# Altium project PB-F-0213 Fusion - SUPI Platform.PrjPcb
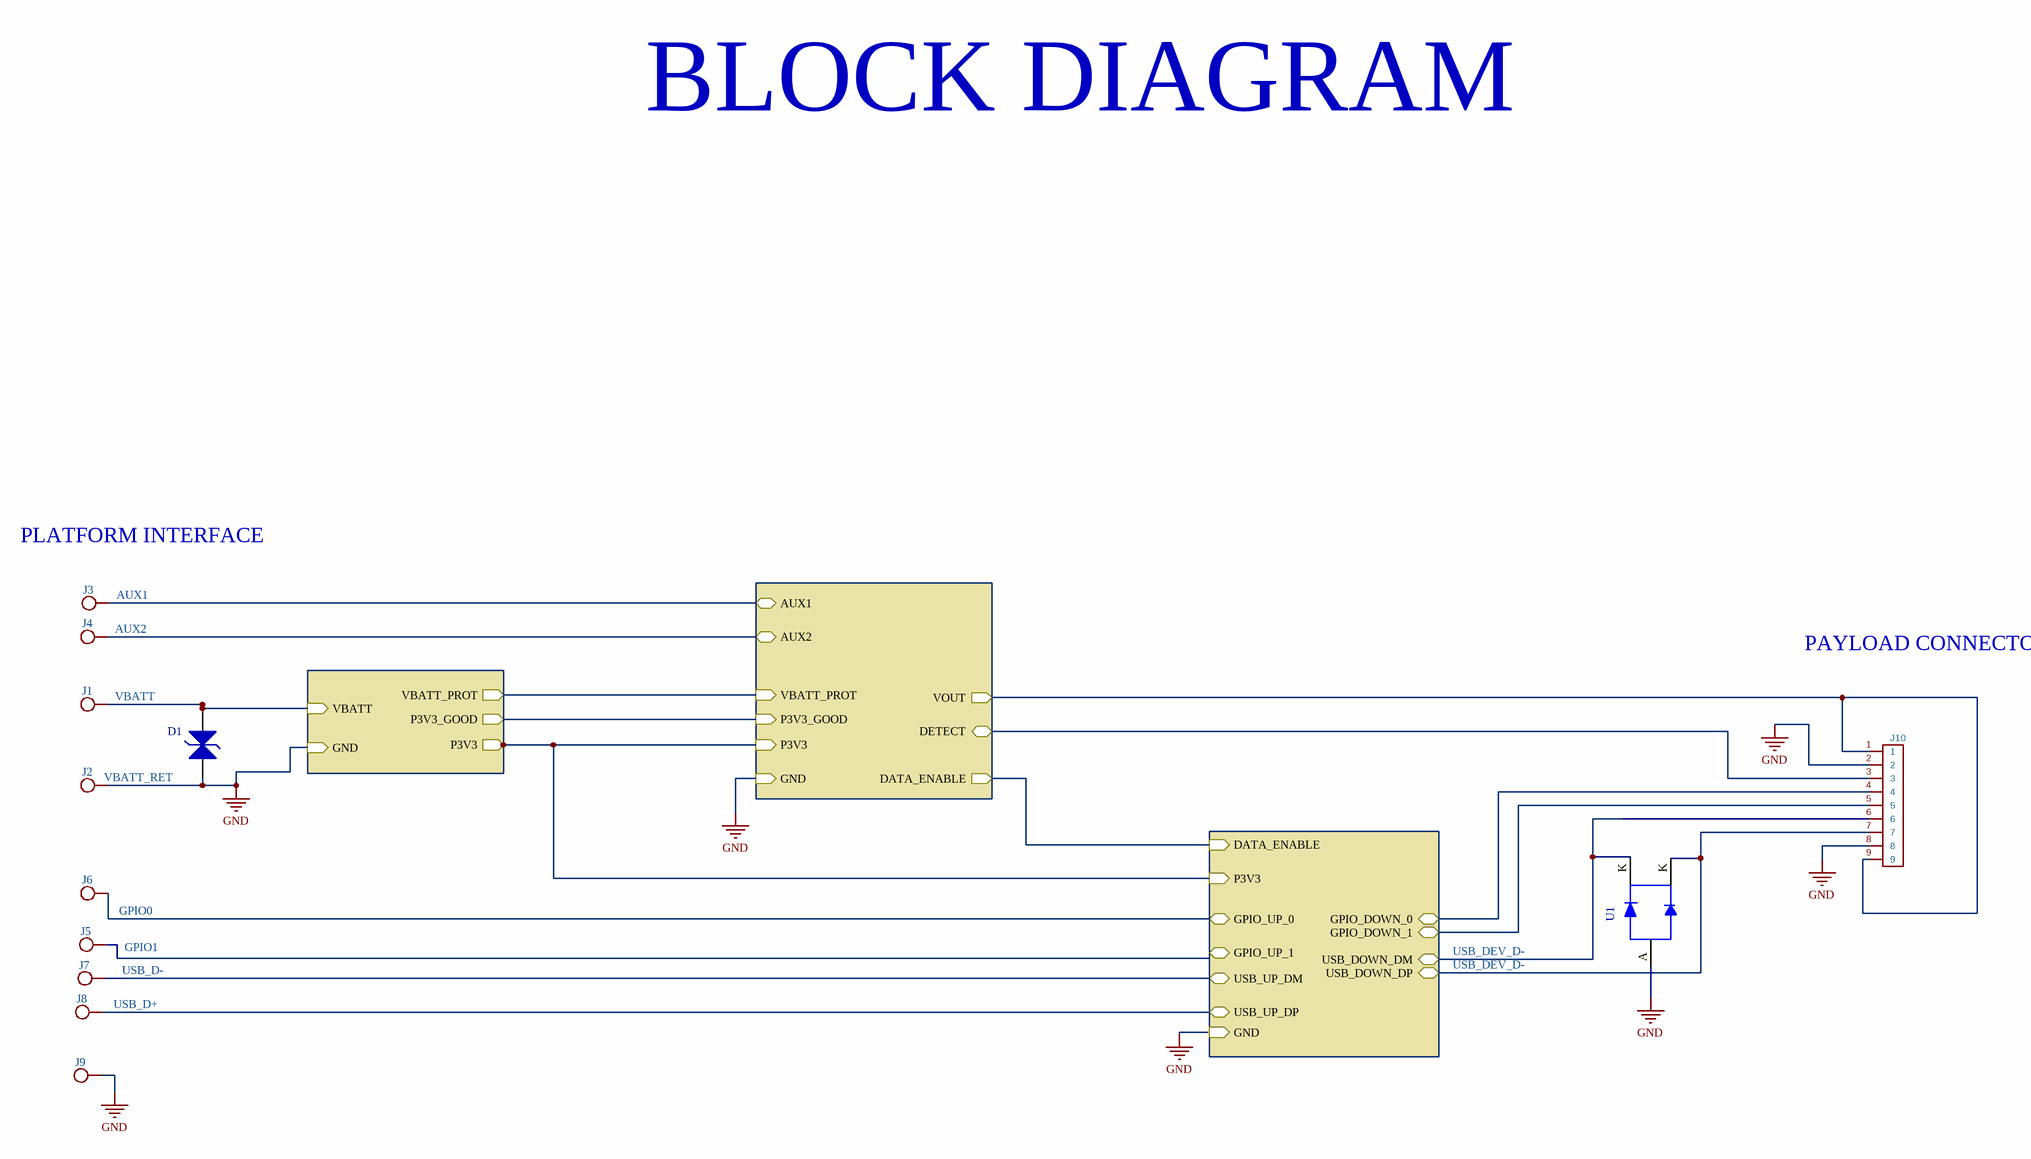
[diagram p0: 100046138_block_diagram.SchDoc]
Part_Number: PB-F-0210
4 sheets, 82 parts. Net scope: hierarchical (ports join the sheet entries above them; power ports are global).
Board file: 100064667.PcbDoc
Sheets:
  100046138_block_diagram.SchDoc
    Data Switches = 100046138_data_switches.SchDoc
    Payload Power Control = 100046138_output_control.SchDoc
    Power Input = 100046138_power.SchDoc

## Sheet 100046138_block_diagram.SchDoc
size 863 x 558 mm; SheetNumber: 1; SheetTotal: 4

### Parts
D1  SMF26A  [DI-SOD123F-A]  (value not drawn)
J1  ~  [PTH_18AWG]  (value not drawn)
J2  (no value)  [PTH_18AWG]
J3  (no value)  [PTH_24AWG_offset_rectangular]
J4  (no value)  [PTH_24AWG_offset_rectangular]
J5  (no value)  [PTH_24AWG_offset_rectangular]
J6  ~  [PTH_24AWG_offset_rectangular]  (value not drawn)
J7  ~  [PTH_24AWG_offset_rectangular]  (value not drawn)
J8  ~  [PTH_24AWG_offset_rectangular]  (value not drawn)
J9  ~  [PTH_24AWG_offset_rectangular]  (value not drawn)
J10  ~  [399-10-109-10-007000]  (value not drawn)
U1  PESD5V0C2UM  [IC-SOT883-2-B]  (value not drawn)

### Sub-sheets
Data Switches = 100046138_data_switches.SchDoc: GND (in), P3V3 (in), USB_DOWN_DP (bidir), USB_DOWN_DM (bidir), USB_UP_DP (bidir), USB_UP_DM (bidir), DATA_ENABLE (in), GPIO_DOWN_0 (bidir), GPIO_DOWN_1 (bidir), GPIO_UP_0 (bidir), GPIO_UP_1 (bidir)
Payload Power Control = 100046138_output_control.SchDoc: P3V3 (in), GND (in), VOUT (out), VBATT_PROT (in), AUX1 (bidir), AUX2 (bidir), P3V3_GOOD (in), DETECT (bidir), DATA_ENABLE (out)
Power Input = 100046138_power.SchDoc: VBATT (in), GND (in), P3V3 (out), VBATT_PROT (out), P3V3_GOOD (out)

### Nets
GND: D1.A J2.1 J9.1 J10.2 J10.8 U1.A ; sheet Payload Power Control/GND, sheet Power Input/GND
AUX1: J3.1 ; sheet Payload Power Control/AUX1
AUX2: J4.1 ; sheet Payload Power Control/AUX2
GPIO0: J6.1 ; sheet Data Switches/GPIO_UP_0
USB_D+: J8.1 ; sheet Data Switches/USB_UP_DP
USB_D-: J7.1 ; sheet Data Switches/USB_UP_DM
USB_DEV_D-: J10.6 J10.7 U1.K ; sheet Data Switches/USB_DOWN_DP, sheet Data Switches/USB_DOWN_DM
VBATT: D1.K J1.1 ; sheet Power Input/VBATT
NetC2_2: sheet Payload Power Control/VBATT_PROT, sheet Power Input/VBATT_PROT
NetC4_2: sheet Data Switches/P3V3, sheet Payload Power Control/P3V3, sheet Power Input/P3V3
NetC8_2: J10.3 ; sheet Payload Power Control/DETECT
NetC15_1: J10.1 J10.9 ; sheet Payload Power Control/VOUT
NetJ10_4: J10.4 ; sheet Data Switches/GPIO_DOWN_0
NetJ10_5: J10.5 ; sheet Data Switches/GPIO_DOWN_1
NetU4_5: sheet Payload Power Control/P3V3_GOOD, sheet Power Input/P3V3_GOOD
NetU11_4: sheet Data Switches/DATA_ENABLE, sheet Payload Power Control/DATA_ENABLE

Not connected (* = marked no-connect by the designer): J5 1

### Notes on the sheet
- BLOCK DIAGRAM
- PLATFORM INTERFACE
- PAYLOAD CONNECTOR
- Labels drawn without touching a wire or pin: GPIO1, VBATT_RET
- DWG NO
- REVISIONS
- SH
- REVISION
- DESCRIPTION
- DATE(YEAR-MO-DA)
- APPROVED
- THIS DRAWING IS CAD MAINTAINED.
  CHANGES SHALL BE INCORPORATED
  BY THE DESIGN ACTIVITY.
- PART NO.
- CONTRACT NUMBER
- DESIGN ACTIVITY
- CONTRACTOR
- US ARMY
  COMBAT CAPABILITIES DEVELOPMENT COMMAND ARMAMENTS CENTER
  PICATINNY ARSENAL, NEW JERSEY 07806-5000
- DRAWN BY
- ENGINEER
- CHECKER
- QUALITY ENGINEER
- DRAWING APPROVAL
- SIZE
- CAGE CODE
- DWG NO.
- NEXT ASSY
- USED ON
- DESIGN APPROVAL
- D
- 19200
- APPLICATION
- SCALE
- NONE
- UNIT WT.
- ---
- SHEET

### Library data of the parts
D1 = CMP-00657-1: SMF Series 200 W 26 V Uni-Directional Surface Mount TVS Diode - SOD-123F; Breakdown Voltage: 30.4V; Clamping Voltage: 42.1V; Max Breakdown Voltage: 31.9V; Max Power Dissipation: 1W; Max Reverse Leakage Current: 1µA; Max Surge Current: 4.8A; Min Breakdown Voltage: 28.9V; Number of Channels: 1; Peak Pulse Power: 1kW; Polarity: Unidirectional; Power Line Protection: No; Reverse Standoff Voltage: 26V; Test Current: 1mA; Footprint: 1a_Littelfuse:SOD-123FL; Composition: Zener; Lead Free: Lead Free; Lifecycle Status: Production; Max Operating Temperature: 150°C; Min Operating Temperature: -65°C; Mounting Technology: Surface Mount; Number of Elements: 1; Number of Terminals: 2; Number of Unidirectional Channels: 1; Packaging: Cut Tape; Peak Pulse Current: 4.8A; Peak Reverse Current: 1µA; REACH SVHC: No; Reverse Voltage: 26V; RoHS: Compliant; Schedule B: 8541100080; Termination: SMD/SMT
J1 J2 = PTH_18AWG: Footprint: 1a_Misc:PTH_18AWG
J3-J9 = PTH_24AWG_offset_rectangle: Footprint: 1a_Misc:PTH_24AWG_offset_rectangular
J10 = 399-10-109-10-007000: Manufacturer: Mill-Max Manufacturing Corp.; MPN: 399-10-109-10-007000; Footprint: 1a_Misc:399-10-109-10-007000
U1 = CMP-00652-2: Extremely low capacitance unidirectional ESD protection diode array; Manufacturer Lifecycle Status: RELEASED FOR SUPPLY; Lifecycle Status: Production

## Sheet 100046138_data_switches.SchDoc
size 863 x 558 mm; SheetNumber: 2; SheetTotal: 4
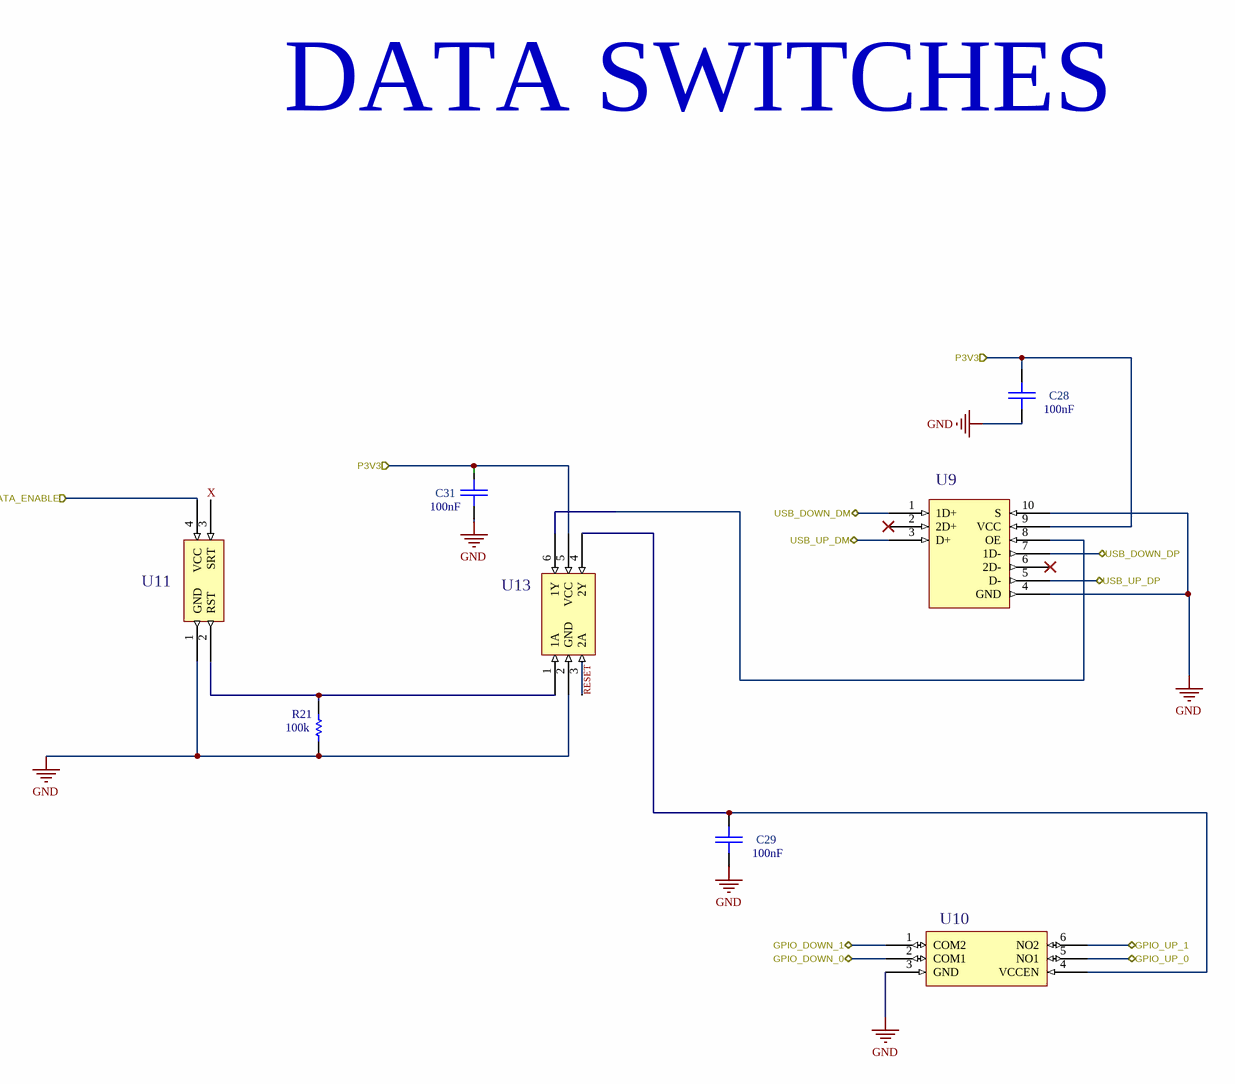
[diagram p1: 100046138_data_switches.SchDoc]

### Parts
C28  value 100nF  [CAP-0402-A]  (hidden comment: Cap 0402 100nF 10% X7R)
C29  value 100nF  [CAP-0402-A]  (hidden comment: Cap 0402 100nF 10% X7R)
C31  value 100nF  [CAP-0402-A]  (hidden comment: Cap 0402 100nF 10% X7R)
R21  value 100k  [RES-0402-C]  (hidden comment: Res 0402 100K 1/10W 1% Thick Flim)
U9  TC7USB40MU  [IC-UQFN10-A]  (value not drawn)
U10  MAX20336AEFT+T  [IC-FC2QFN-A]  (value not drawn)
U11  MAX821UUS+T  [IC-SOT143-4-A]  (value not drawn)
U13  SN74AUP2G04DRYR  [IC-SON6-A]  (value not drawn)

### Ports
DATA_ENABLE (in), GPIO_DOWN_0 (bidir), GPIO_DOWN_1 (bidir), GPIO_UP_0 (bidir), GPIO_UP_1 (bidir), P3V3 (in), USB_DOWN_DM (bidir), USB_DOWN_DP (bidir), USB_UP_DM (bidir), USB_UP_DP (bidir)

### Nets
GND: C28.1 C29.1 C31.2 R21.1 U9.4(GND) U9.10(S) U10.3(GND) U11.1(GND) U13.2(GND)
GPIO0: U10.5(NO1) ; port GPIO_UP_0
USB_D+: U9.5(D-) ; port USB_UP_DP
USB_D-: U9.3(D+) ; port USB_UP_DM
USB_DEV_D-: U9.1(1D+) U9.7(1D-) ; port USB_DOWN_DP, port USB_DOWN_DM
NetC4_2: C28.2 C31.1 U9.9(VCC) U13.5(VCC) ; port P3V3
NetC29_2: C29.2 U10.4(VCCEN) U13.4(2Y)
NetJ10_4: U10.2(COM1) ; port GPIO_DOWN_0
NetJ10_5: U10.1(COM2) ; port GPIO_DOWN_1
NetR21_2: R21.2 U11.2(RST) U13.1(1A)
NetU9_8: U9.8(OE) U13.6(1Y)
NetU10_6: U10.6(NO2) ; port GPIO_UP_1
NetU11_4: U11.4(VCC) ; port DATA_ENABLE

Not connected (* = marked no-connect by the designer): U9 2(2D+)* 6(2D-)*; U11 3(SRT); U13 3(2A)

### Notes on the sheet
- DATA SWITCHES
- (near U11) X
- Labels drawn without touching a wire or pin: RESET
- DWG NO
- REVISIONS
- SH
- REVISION
- DESCRIPTION
- DATE(YEAR-MO-DA)
- APPROVED
- PART NO.
- DESIGN ACTIVITY
- US ARMY
  COMBAT CAPABILITIES DEVELOPMENT COMMAND ARMAMENTS CENTER
  PICATINNY ARSENAL, NEW JERSEY 07806-5000
- SIZE
- CAGE CODE
- DWG NO.
- D
- 19200
- SCALE
- NONE
- UNIT WT.
- ---
- SHEET

### Library data of the parts
C28 C29 C31 = CAP-00363-2: Leader Qty: 100; UOM: EA; Voltage Rating: 50V; Footprint: Capacitor_SMD:C_0402_1005Metric; Case/Package: 0402; Max Operating Temperature: 125°C; Min Operating Temperature: -55°C; Mounting Technology: Surface Mount; Tolerance: 10%
R21 = RES-00031-9: Leader Qty: 100; Footprint: Resistor_SMD:R_0402_1005Metric; Case/Package: 0402; Max Operating Temperature: 155°C; Min Operating Temperature: -55°C; Mounting Technology: SMT; Pins: 2; RoHS Compliant: Yes; Tolerance: 1%
U9 = IC-00423-1: USB Interface, 1: 2 Multiplexer/Demultiplexer Switch, USB 2.0, 2.3 V, 4.3 V, UQFN-B, 10 Pins; Footprint: 1a_Misc:Toshiba UQFN-10_1.4x1.8mm_P0.4mm; Schedule B: 8542390000|8542390000|8542390000|8542390000|8542390000
U10 = IC-00417-1: Industry's Smallest DPST Can Switch ±5.5V Signals with a Single VCC as Low as 1.6V; Manufacturer Lifecycle Status: PRODUCTION; Footprint: 1a_Misc:FC2QFN-6; Lifecycle Status: Production; RoHS: Compliant
U11 = IC-00421-1: 4-Pin, µP Voltage Monitors with Pin-Selectable Power-On Reset Timeout Delay; Manufacturer Lifecycle Status: PRODUCTION; Max Power Dissipation: 320mW; Max Reset Threshold Voltage: 2.81V; Max Supply Current: 5.5µA; Max Supply Voltage: 5.5V; Min Reset Threshold Voltage: 2.74V; Min Supply Voltage: 1V; Nominal Supply Current: 1.8µA; Number of Outputs: 1; Output Current: 20mA; Reset: Active Low; Threshold Voltage: 2.78V; Watchdog Timer: No; Footprint: 1a_Misc:SOT-143 Maxim; Case/Package: SOT-143-4; Height: 1.22mm; Lead Free: Lead Free; Lifecycle Status: Production; Max Operating Temperature: 125°C; Min Operating Temperature: -40°C; Mounting Technology: Surface Mount; Number of Voltages Monitored: 1; Operating Supply Current: 5.5µA; Overvoltage Threshold: 2.81V; Pins: 4; Radiation Hardening: No; RoHS: Compliant; Type: Simple Reset/Power-On Reset; Undervoltage Threshold: 2.74V
U13 = IC-00422-1: IC INVERTER 2CH 2-INP 6SON Inverter IC 2 Channel 6-SON (1.45x1); Manufacturer Lifecycle Status: ACTIVE; High Level Output Current: -4mA; Logic Function: Buffer, Inverter; Low Level Output Current: 4mA; Max Supply Voltage: 3.6V; Min Supply Voltage: 800mV; Number of Bits: 2; Number of Inputs: 1; Propagation Delay: 6.2ns; Quiescent Current: 500nA; Turn-On Delay Time: 25.5ns; Footprint: 1a_Misc:QFN-6_1.4x1mm_P0.5mm TI DRY6; Height: 600µm; Lead Free: Lead Free; Length: 1.45mm; Lifecycle Status: Production; Max Operating Temperature: 85°C; Min Operating Temperature: -40°C; Mounting Technology: Surface Mount; Number of Circuits: 2; Number of Elements: 2; Number of Gates: 2; Packaging: Digi-Reel®; Pins: 6; Radiation Hardening: No; RoHS: Compliant; Thickness: 500µm; Width: 1mm

## Sheet 100046138_output_control.SchDoc
size 863 x 558 mm; SheetNumber: 3; SheetTotal: 4
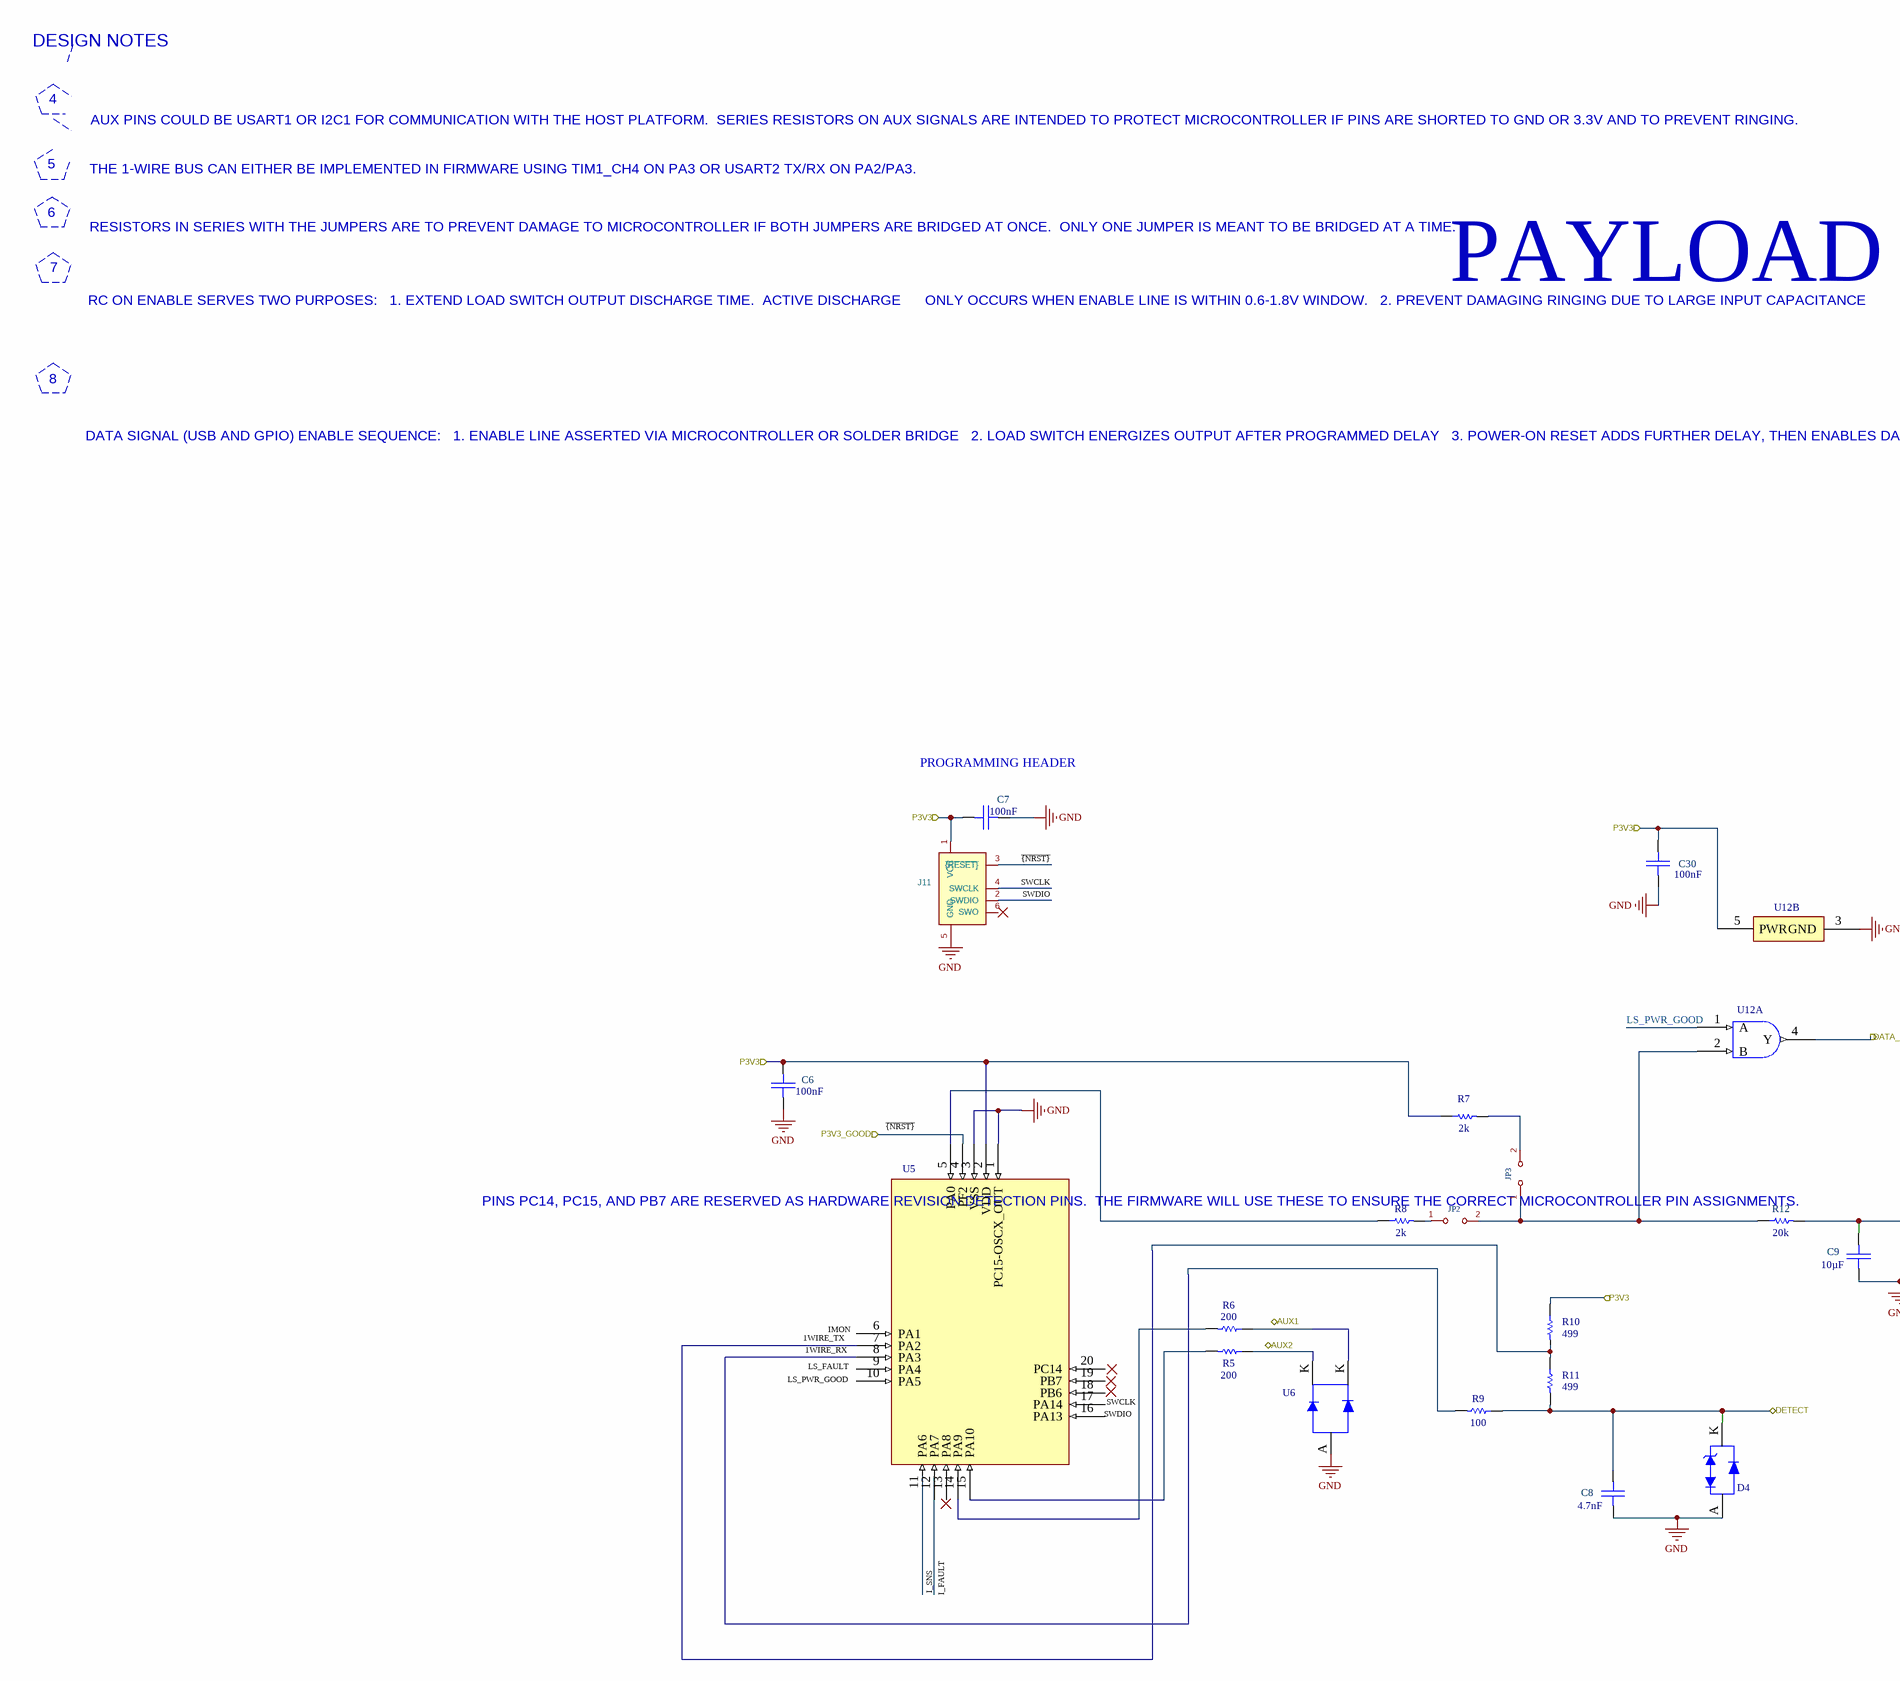
[diagram p2: 100046138_output_control.SchDoc, left]
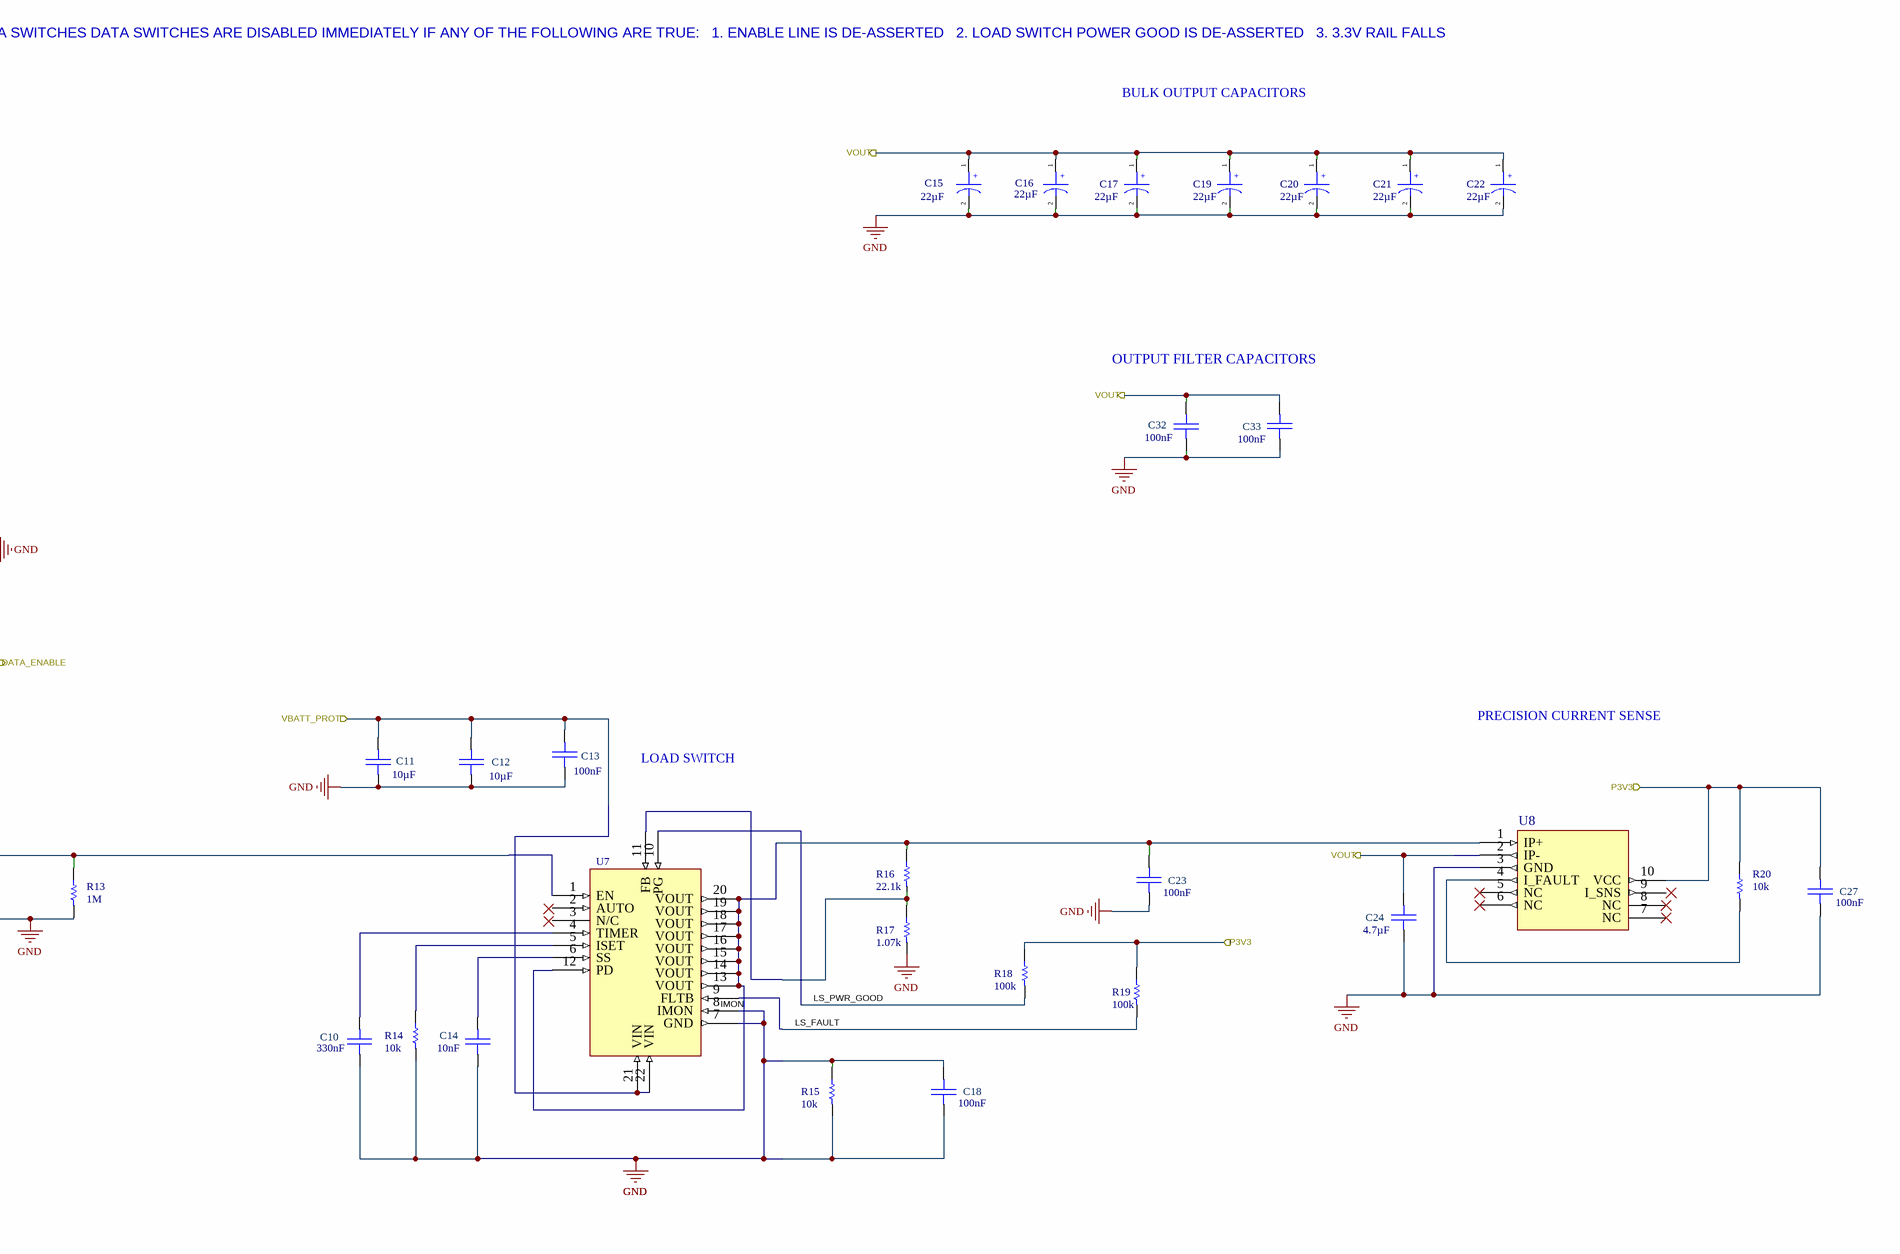
[diagram p3: 100046138_output_control.SchDoc, right]

### Parts
C6  value 100nF  [CAP-0402-A]  (hidden comment: Cap 0402 100nF 10% X7R)
C7  value 100nF  [CAP-0402-A]  (hidden comment: Cap 0402 100nF 10% X7R)
C8  value 4.7nF  [CAP-0402-A]  (hidden comment: CAP 0402 4700PF 50V 10% X7R)
C9  value 10µF  [CAP-0402-A]  (hidden comment: Cap 0402 10uF 10V 20% X5R)
C10  value 330nF  [CAP-0402-A]  (hidden comment: Cap 0402 0.33uF 16V 10% X7S)
C11  value 10µF  [CAP-0805-A]  (hidden comment: CAP 0805 10UF 50V 10% X5R)
C12  value 10µF  [CAP-0805-A]  (hidden comment: CAP 0805 10UF 50V 10% X5R)
C13  value 100nF  [CAP-0402-A]  (hidden comment: Cap 0402 100nF 10% X7R)
C14  value 10nF  [CAP-0402-A]  (hidden comment: Cap 0402 10000pf 50V 10% X7R)
C15  value 22µF  [CAP-0805-A]  (hidden comment: CAP 0805 22uF 35V 20% X5R)
C16  value 22µF  [CAP-0805-A]  (hidden comment: CAP 0805 22uF 35V 20% X5R)
C17  value 22µF  [CAP-0805-A]  (hidden comment: CAP 0805 22uF 35V 20% X5R)
C18  value 100nF  [CAP-0402-A]  (hidden comment: Cap 0402 100nF 10% X7R)
C19  value 22µF  [CAP-0805-A]  (hidden comment: CAP 0805 22uF 35V 20% X5R)
C20  value 22µF  [CAP-0805-A]  (hidden comment: CAP 0805 22uF 35V 20% X5R)
C21  value 22µF  [CAP-0805-A]  (hidden comment: CAP 0805 22uF 35V 20% X5R)
C22  value 22µF  [CAP-0805-A]  (hidden comment: CAP 0805 22uF 35V 20% X5R)
C23  value 100nF  [CAP-0402-A]  (hidden comment: Cap 0402 100nF 10% X7R)
C24  value 4.7µF  [CAP-0805-A]  (hidden comment: CAP 0805 4.7UF 50V 10% X7R)
C27  value 100nF  [CAP-0402-A]  (hidden comment: Cap 0402 100nF 10% X7R)
C30  value 100nF  [CAP-0402-A]  (hidden comment: Cap 0402 100nF 10% X7R)
C32  value 100nF  [CAP-0402-A]  (hidden comment: Cap 0402 100nF 10% X7R)
C33  value 100nF  [CAP-0402-A]  (hidden comment: Cap 0402 100nF 10% X7R)
D4  SMF3.3  [DI-SOD123F-A]  (value not drawn)
J11  Conn_ARM_SWD_TagConnect_TC2030-NL  [Tag-Connect_TC2030-IDC-NL_2x03_P1.27mm_Vertical]  (value not drawn)
JP2  Jumper_2_Bridged  [SolderJumper-2_P1.3mm_Open_TrianglePad1.0x1.5mm]  (value not drawn)
JP3  Jumper_2_Open  [SolderJumper-2_P1.3mm_Open_TrianglePad1.0x1.5mm]  (value not drawn)
R5  value 200  [RES-0402-A]  (hidden comment: RES 0402 200 OHM 1/10W 1%)
R6  value 200  [RES-0402-A]  (hidden comment: RES 0402 200 OHM 1/10W 1%)
R7  value 2k  [RES-0402-B]  (hidden comment: Res 0402 2K Ohm 1/10W 1% Thick Flim)
R8  value 2k  [RES-0402-B]  (hidden comment: Res 0402 2K Ohm 1/10W 1% Thick Flim)
R9  value 100  [RES-0402-B]  (hidden comment: Res 0402 100 Ohm 0.1W 1% Thick Film)
R10  value 499  [RES-0402-A]  (hidden comment: RES 0402 499 OHM 1/10W 1%)
R11  value 499  [RES-0402-A]  (hidden comment: RES 0402 499 OHM 1/10W 1%)
R12  value 20k  [RES-0402-A]  (hidden comment: Res 0402 20k 1/16W 1% Thick Film)
R13  value 1M  [RES-0402-C]  (hidden comment: Res 0402 1.00M 0.1W 1% Thick Film)
R14  value 10k  [RES-0402-A]  (hidden comment: RES 0402 10K 1/10W 1%)
R15  value 10k  [RES-0402-A]  (hidden comment: RES 0402 10K 1/10W 1%)
R16  value 22.1k  [RES-0402-A]  (hidden comment: RES 0402 22.1K 1/10W 1%)
R17  value 1.07k  [RES-0402-A]  (hidden comment: RES 0402 1.07K 1/10W 1%)
R18  value 100k  [RES-0402-C]  (hidden comment: Res 0402 100K 1/10W 1% Thick Flim)
R19  value 100k  [RES-0402-C]  (hidden comment: Res 0402 100K 1/10W 1% Thick Flim)
R20  value 10k  [RES-0402-A]  (hidden comment: RES 0402 10K 1/10W 1%)
U5  STM32C011F6U6TR  [IC-UFQFPN20-A]  (value not drawn)
U6  PESD5V0C2UM  [IC-SOT883-2-B]  (value not drawn)
U7  MPQ5069GQV-AEC1-Z  [IC-QFN22-3X5-A]  (value not drawn)
U8  ACS711KEXLT-15AB-T  [QFN127P600-8N]  (value not drawn)
U12  Gate - AND  [IC-SOT553-A]  (value not drawn)  (parts A,B of 2)

### Ports
AUX1 (bidir), AUX2 (bidir), DATA_ENABLE (out), DETECT (bidir), P3V3 (in), P3V3_GOOD (in), VBATT_PROT (in), VOUT (out)

### Nets
GND: C6.1 C7.2 C8.1 C9.1 C10.1 C11.1 C12.1 C13.1 C14.1 C15.2 C16.2 C17.2 C18.1 C18.2 C19.2 C20.2 C21.2 C22.2 C23.1 C24.1 C27.2 C30.1 C32.2 C33.1 D4.A J11.5(GND) R13.1 R14.1 R15.1 R15.2 R17.1 U5.1(PC15-OSCX_OUT) U5.3(VSS) U7.7(GND) U7.8(IMON) U8.3(GND) U12.3(GND)
LS_FAULT: R19.1 U7.9(FLTB)
LS_PWR_GOOD: R18.1 U7.10(PG) U12.1(A)
SWCLK: J11.4(SWCLK)
SWDIO: J11.2(SWDIO)
~{{NRST}}: J11.3(~{{RESET}})
NetC2_2: C11.2 C12.2 C13.2 U7.21(VIN) U7.22(VIN) ; port VBATT_PROT
NetC4_2: C6.2 C7.1 C27.1 C30.2 J11.1(VCC) R7.2 R10.2 R18.2 R19.2 R20.2 U5.2(VDD) U8.10(VCC) U12.5(PWR) ; port P3V3
NetC8_2: C8.2 D4.K R9.2 R11.1 ; port DETECT
NetC9_2: C9.2 R12.1 R13.2 U7.1(EN)
NetC10_2: C10.2 U7.4(TIMER)
NetC14_2: C14.2 U7.6(SS)
NetC15_1: C15.1 C16.1 C17.1 C19.1 C20.1 C21.1 C22.1 C24.2 C32.1 C33.2 U8.2(IP-) ; port VOUT
NetC23_2: C23.2 R16.2 U7.12(PD) U7.13(VOUT) U7.14(VOUT) U7.15(VOUT) U7.16(VOUT) U7.17(VOUT) U7.18(VOUT) U7.19(VOUT) U7.20(VOUT) U8.1(IP+)
NetJP2_1: JP2.1(A) R8.1
NetJP2_2: JP2.2(B) JP3.1(A) R12.2 U12.2(B)
NetJP3_2: JP3.2(B) R7.1
NetR5_1: R5.1 U5.15(PA10)
NetR5_2: R5.2 U6.K
NetR6_1: R6.1 U5.14(PA9)
NetR6_2: R6.2 U6.K
NetR8_2: R8.2 U5.5(PA0)
NetR9_1: R9.1 U5.8(PA3)
NetR10_1: R10.1 R11.2 U5.7(PA2)
NetR14_2: R14.2 U7.5(ISET)
NetR16_1: R16.1 R17.2 U7.11(FB)
NetR20_1: R20.1 U8.4(I_FAULT)
NetU4_5: U5.4(PF2) ; port P3V3_GOOD
NetU11_4: U12.4(Y) ; port DATA_ENABLE

Not connected (* = marked no-connect by the designer): J11 6(SWO); U5 6(PA1) 9(PA4) 10(PA5) 11(PA6) 12(PA7) 13(PA8) 16(PA13) 17(PA14) 18(PB6) 19(PB7) 20(PC14); U6 A; U7 2(AUTO) 3(N/C); U8 5(NC)* 6(NC)* 7(NC)* 8(NC)* 9(I_SNS)

### Notes on the sheet
- DESIGN NOTES
- 4
- AUX PINS COULD BE USART1 OR I2C1 FOR COMMUNICATION
  WITH THE HOST PLATFORM.  SERIES RESISTORS ON AUX SIGNALS
  ARE INTENDED TO PROTECT MICROCONTROLLER IF PINS ARE
  SHORTED TO GND OR 3.3V AND TO PREVENT RINGING.
- 5
- THE 1-WIRE BUS CAN EITHER BE IMPLEMENTED IN FIRMWARE
  USING TIM1_CH4 ON PA3 OR USART2 TX/RX ON PA2/PA3.
- 6
- 7
- RESISTORS IN SERIES WITH THE JUMPERS ARE TO PREVENT
  DAMAGE TO MICROCONTROLLER IF BOTH JUMPERS ARE BRIDGED
  AT ONCE.  ONLY ONE JUMPER IS MEANT TO BE BRIDGED AT A TIME.
- RC ON ENABLE SERVES TWO PURPOSES:
  1. EXTEND LOAD SWITCH OUTPUT DISCHARGE TIME.  ACTIVE DISCHARGE
  ONLY OCCURS WHEN ENABLE LINE IS WITHIN 0.6-1.8V WINDOW.
  2. PREVENT DAMAGING RINGING DUE TO LARGE INPUT CAPACITANCE
- PAYLOAD POWER CONTROL
- 8
- DATA SIGNAL (USB AND GPIO) ENABLE SEQUENCE:
  1. ENABLE LINE ASSERTED VIA MICROCONTROLLER OR SOLDER BRIDGE
  2. LOAD SWITCH ENERGIZES OUTPUT AFTER PROGRAMMED DELAY
  3. POWER-ON RESET ADDS FURTHER DELAY, THEN ENABLES DATA SWITCHES
  DATA SWITCHES ARE DISABLED IMMEDIATELY IF ANY OF THE FOLLOWING ARE TRUE:
  1. ENABLE LINE IS DE-ASSERTED
  2. LOAD SWITCH POWER GOOD IS DE-ASSERTED
  3. 3.3V RAIL FALLS BELOW POWER-ON RESET THRESHOLD
- BULK OUTPUT CAPACITORS
- (near C7) PROGRAMMING HEADER
- OUTPUT FILTER CAPACITORS
- PRECISION CURRENT SENSE
- LOAD SWITCH
- (near U5) PINS PC14, PC15, AND PB7 ARE
  RESERVED AS HARDWARE REVISION
  DETECTION PINS.  THE FIRMWARE
  WILL USE THESE TO ENSURE THE
  CORRECT MICROCONTROLLER PIN
  ASSIGNMENTS.
- Labels drawn without touching a wire or pin: 1WIRE_RX, 1WIRE_TX, GND, I_FAULT, I_SNS, IMON, LS_FAULT, LS_PWR_GOOD, SWCLK, SWDIO, ~{{NRST}}
- DWG NO
- REVISIONS
- SH
- REVISION
- DESCRIPTION
- DATE(YEAR-MO-DA)
- APPROVED
- PART NO.
- DESIGN ACTIVITY
- US ARMY
  COMBAT CAPABILITIES DEVELOPMENT COMMAND ARMAMENTS CENTER
  PICATINNY ARSENAL, NEW JERSEY 07806-5000
- SIZE
- CAGE CODE
- DWG NO.
- D
- 19200
- SCALE
- NONE
- UNIT WT.
- ---
- SHEET
- (in symbol CAP-00375-1) +

### Library data of the parts
C6 C7 C13 C18 C23 C27 C30 C32 C33 = CAP-00363-2: as C28 on sheet 100046138_data_switches; Footprint: Capacitor_SMD:C_0402_1005Metric; Case/Package: 0402; Max Operating Temperature: 125°C; Min Operating Temperature: -55°C; Mounting Technology: Surface Mount; Tolerance: 10%
C8 = CAP-00371-1: Leader Qty: 100; UOM: EA; Footprint: Capacitor_SMD:C_0402_1005Metric; Case/Package: 0402; Max Operating Temperature: 150°C; Min Operating Temperature: -55°C; Mounting Technology: Surface Mount; Tolerance: 10%
C9 = CAP-00021-6: Capacitor Type: Ceramic; Leader Qty: 100; Footprint: Capacitor_SMD:C_0402_1005Metric; Case/Package: 0402; Max Operating Temperature: 85°C; Min Operating Temperature: -55°C; Mounting Technology: SMT; Pins: 2; RoHS Compliant: Yes; Tolerance: 20%; Voltage Rating: 10V
C10 = CAP-00366-2: Leader Qty: 100; UOM: EA; Footprint: Capacitor_SMD:C_0402_1005Metric; Case/Package: 0402; Max Operating Temperature: 125°C; Min Operating Temperature: -55°C; Mounting Technology: Surface Mount; Voltage Rating: 16V
C11 C12 = CAP-00370-1: Leader Qty: 100; UOM: EA; Footprint: Capacitor_SMD:C_0805_2012Metric; Case/Package: 0805; Dielectric: X5R; Max Operating Temperature: 85°C; Min Operating Temperature: -55°C; Mounting Technology: Surface Mount
C14 = CAP-00186-4: 0402 10 nF 50 V ±10 % Tolerance X7R SMT Multilayer Ceramic Capacitor; Leader Qty: 100; Footprint: Capacitor_SMD:C_0402_1005Metric; Case/Package: 0402; Case Code (Imperial): 0402; Max Operating Temperature: 125°C; Min Operating Temperature: -55°C; Mounting Technology: Surface Mount; RoHS Compliant: Yes; Tolerance: 10%; Voltage Rating: 50V
C15-C17 C19-C22 = CAP-00375-1: Leader Qty: 25; Footprint: Capacitor_SMD:C_0805_2012Metric; Case/Package: 0805; Max Operating Temperature: 85°C; Min Operating Temperature: -55°C; Mounting Technology: Surface Mount; Tolerance: 20%; Voltage Rating: 35V
C24 = CAP-00372-1: Leader Qty: 100; UOM: EA; Footprint: Capacitor_SMD:C_0805_2012Metric; Case/Package: 0805; Max Operating Temperature: 125°C; Min Operating Temperature: -55°C; Mounting Technology: Surface Mount; Voltage Rating: 50V
D4 = CMP-00658-1: ESD protection diodes / TVS diodes; LITTELFUSE; SMF3.3; 6.8 V; 30 A; 3.3 V; 3.4 V - 4.3 V; Breakdown Voltage: 3.85V; Clamping Voltage: 6.8V; Direction: Unidirectional; Forward Voltage: 16V; Max Breakdown Voltage: 4.3V; Max Junction Temperature (Tj): 150°C; Max Power Dissipation: 1.7W; Max Reverse Leakage Current: 500nA; Min Breakdown Voltage: 3.4V; Number of Channels: 1; Peak Pulse Current: 30A; Peak Pulse Power: 200W; Reverse Standoff Voltage: 3.3V; Test Current: 10mA; Footprint: 1a_Littelfuse:SOD-123FL; Country of Origin: Mainland China; Export Control Classification Number (ECCN) Code: EAR99; Harmonized Tariff Schedule (HTS) Code: 8541.10.00.50; Height: 1.08mm; Introduction Date: 2016-08-01; Lifecycle Status: Production; Max Operating Temperature: 150°C; Min Operating Temperature: -55°C; Number of Elements: 1; Number of Terminals: 2; Packaging: Cut Tape; Peak Reverse Current: 500nA; Polarity: Unidirectional; REACH SVHC: No; Reverse Voltage: 3.3V; RoHS: Compliant; Schedule B: 8541100080
J11 = Conn_ARM_SWD_TagConnect_TC2030-NL: Manufacturer: Tag-Connect LLC; MPN: TC2030-CTX; Value: Conn_ARM_SWD_TagConnect_TC2030-NL; Footprint: Connector:Tag-Connect_TC2030-IDC-NL_2x03_P1.27mm_Vertical
R5 R6 = RES-00801-1: Leader Qty: 100; UOM: EA; Voltage Rating: 50V; Footprint: Resistor_SMD:R_0402_1005Metric; Case/Package: 0402; Max Operating Temperature: 155°C; Min Operating Temperature: -55°C; Mounting Technology: Surface Mount; Tolerance: 1%
R7 R8 = RES-00296-6: Leader Qty: 100; Power: 100mW; Voltage Rating: 50V; Footprint: Resistor_SMD:R_0402_1005Metric; Case/Package: 0402; Max Operating Temperature: 155°C; Min Operating Temperature: -55°C; Mounting Technology: SMT; Pins: 2; RoHS Compliant: Yes; Tolerance: 1%
R9 = RES-00021-9: Power: 100mW; Voltage Rating: 100V; Footprint: Resistor_SMD:R_0402_1005Metric; Case/Package: 0402; Leader Qty: 100; Max Operating Temperature: 155°C; Min Operating Temperature: -55°C; Mounting Technology: SMD; Pins: 2; Tolerance: 1%
R10 R11 = RES-00802-1: Leader Qty: 100; UOM: EA; Voltage Rating: 50V; Footprint: Resistor_SMD:R_0402_1005Metric; Case/Package: 0402; Max Operating Temperature: 155°C; Min Operating Temperature: -55°C; Mounting Technology: Surface Mount; Tolerance: 1%
R12 = RES-00405-6: Leader Qty: 100; Max Power Dissipation: 63mW; Power Rating: 62.5mW; Temperature Coefficient: 100ppm/°C; UOM: EA; Voltage Rating (DC): 50V; Footprint: Resistor_SMD:R_0402_1005Metric; Case/Package: 0402; Case Code (Imperial): 0402; Features: Moisture Resistant; Max Operating Temperature: 155°C; Min Operating Temperature: -55°C; Pins: 2; Resistance Tolerance: 1%; Resistor Type: Thick Film; RoHS Compliant: Yes; Series: RC; Tolerance: 1%; Voltage Rating: 50V
R13 = RES-00025-9: Leader Qty: 100; Power: 100mW; Voltage Rating: 100V; Footprint: Resistor_SMD:R_0402_1005Metric; Case/Package: 0402; Max Operating Temperature: 155°C; Min Operating Temperature: -55°C; Mounting Technology: SMD; Pins: 2; RoHS Compliant: Yes; Tolerance: 1%
R14 R15 R20 = RES-00803-1: Leader Qty: 100; UOM: EA; Voltage Rating: 75V; Footprint: Resistor_SMD:R_0402_1005Metric; Case/Package: 0402; Max Operating Temperature: 155°C; Min Operating Temperature: -55°C; Mounting Technology: Surface Mount; Tolerance: 1%
R16 = RES-00804-1: Leader Qty: 100; UOM: EA; Voltage Rating: 50V; Footprint: Resistor_SMD:R_0402_1005Metric; Case/Package: 0402; Max Operating Temperature: 155°C; Min Operating Temperature: -55°C; Mounting Technology: Surface Mount; Tolerance: 1%
R17 = RES-00805-1: Leader Qty: 100; UOM: EA; Voltage Rating: 50V; Footprint: Resistor_SMD:R_0402_1005Metric; Case/Package: 0402; Max Operating Temperature: 155°C; Min Operating Temperature: -55°C; Mounting Technology: Surface Mount; Tolerance: 1%
R18 R19 = RES-00031-9: Leader Qty: 100; Footprint: Resistor_SMD:R_0402_1005Metric; Case/Package: 0402; Max Operating Temperature: 155°C; Min Operating Temperature: -55°C; Mounting Technology: SMT; Pins: 2; RoHS Compliant: Yes; Tolerance: 1%
U5 = IC-00427-2: RISC Microcontroller, 32-Bit, FLASH, CORTEX-M4F CPU, 180MHz, CMOS, PBGA216; ADC Channels (Resolution): 13-Ch 12-Bit; Clock Frequency: 48MHz; EEPROM Memory Size: 0B; Interface: I2C, I2S, SPI; Max Supply Current: 4.1mA; Max Supply Voltage: 3.6V; Min Supply Voltage: 3V; Number of I/Os: 2; Number of Interrupts: 18; Number of Timers/Counters: 9; Peripherals: POR, PWM; RAM Size: 6kB; China RoHS: Compliant; Country of Origin: Mainland China, Philippines, Taiwan; Export Control Classification Number (ECCN) Code: 3A991.A.2; Harmonized Tariff Schedule (HTS) Code: 8542.31.00.25; Height - Seated (Max): 600µm; Introduction Date: 2023-01-06; Length: 3mm; Lifecycle Status: Production; Max Operating Temperature: 85°C; Memory Format: FLASH; Min Operating Temperature: -40°C; Number of Terminals: 20; Operating Supply Voltage: 3V; REACH SVHC: Yes; RoHS: Compliant; Terminal Pitch: 500µm; Width: 3mm
U6 = CMP-00652-2: as U1 on sheet 100046138_block_diagram; Lifecycle Status: Production
U7 = CMP-00666-1: 7mΩ Protection Switch with Current Monitor for Automotive Battery Systems AEC-Q100 Qualified; Manufacturer Lifecycle Status: ACTIVE; Max Supply Voltage: 28V; Min Supply Voltage: 6V; Number of Channels: 1; Operating Supply Voltage: 12V; Footprint: 1a_Misc:QFN-22_3_x_5mm; Country of Origin: Mainland China; Export Control Classification Number (ECCN) Code: EAR99; Harmonized Tariff Schedule (HTS) Code: 8542.39.00.60; Height - Seated (Max): 1mm; Introduction Date: 2020-12-14; Length: 5mm; Lifecycle Status: Production; Max Operating Temperature: 125°C; Min Operating Temperature: -40°C; Number of Circuits: 1; Number of Terminals: 22; REACH SVHC: Yes; RoHS: Compliant; Width: 3mm
U8 = CMP-00662-1: Linear Current Sensor with Overcurrent Fault Output with <100 V Isolation, QFN-12, RoHS; -3db Bandwidth: 100kHz; Accuracy: 5%; Current Sensing: 15.5A; Isolation Voltage: 100V; Linearity: 1%; Max Supply Current: 5.5mA; Max Supply Voltage: 5.5V; Min Supply Voltage: 3V; Nominal Supply Voltage (DC): 3.3V; Number of Channels: 1; Polarity: Bidirectional; Response Time: 4.6µs; Sensitivity (mV/A): 90mV/A; Footprint: Sensor_Current:Allegro_QFN-12-10-1EP_3x3mm_P0.5mm; Bandwidth: 100kHz; Case/Package: WFQFN; China RoHS: Non-Compliant; Frequency: 100kHz; Height: 750µm; Introduction Date: 2011-03-25; Length: 3mm; Lifecycle Status: Production; Max Operating Temperature: 125°C; Min Operating Temperature: -40°C; Mounting Technology: Surface Mount; Number of Terminals: 12; Packaging: Tape and Reel; Pins: 12; REACH SVHC: Yes; RoHS: Compliant; Schedule B: 8542390000, 8542390000
U12 = IC-00426-1: 1-ch, 2-input 1.65-V to 5.5-V 32 mA drive strength AND gate 5-SOT-5X3 -40 to 125; Manufacturer Lifecycle Status: ACTIVE; High Level Output Current: -32mA; Low Level Output Current: 32mA; Max Junction Temperature (Tj): 150°C; Max Supply Voltage: 5.5V; Min Supply Voltage: 1.65V; Nominal Supply Current: 10µA; Number of Bits: 1; Number of Input Lines: 2; Output Current: 50mA; Propagation Delay: 3.4ns; Schmitt Trigger Input: No; Turn-On Delay Time: 4.5ns; Footprint: 1a_Misc:SOT-553 Texas Instruments DRL; Ambient Temperature Range High: 125°C; Case/Package: SOT-553; Contact Plating: Gold; Height: 0m; Lead Free: Lead Free; Length: 1.6mm; Lifecycle Status: Production; Logic Function: AND; Max Operating Temperature: 125°C; Min Operating Temperature: -40°C; Mounting Technology: Surface Mount; Number of Channels: 1; Number of Circuits: 1; Number of Elements: 1; Number of Gates: 1; Number of Inputs: 2; Number of Output Lines: 1; Number of Outputs: 1; Packaging: Cut Tape; Pins: 5; Quiescent Current: 10µA; Radiation Hardening: No; REACH SVHC: No; RoHS: Compliant; Schedule B: 8542390000, 8542390000; Thickness: 550µm; Weight: 2.806603mg; Width: 1.2mm
JP2 = Jumper_2_Bridged: Value: Jumper_2_Bridged; Footprint: Jumper:SolderJumper-2_P1.3mm_Open_TrianglePad1.0x1.5mm
JP3 = Jumper_2_Open: Value: Jumper_2_Open; Footprint: Jumper:SolderJumper-2_P1.3mm_Open_TrianglePad1.0x1.5mm

## Sheet 100046138_power.SchDoc
size 863 x 558 mm; SheetNumber: 4; SheetTotal: 4
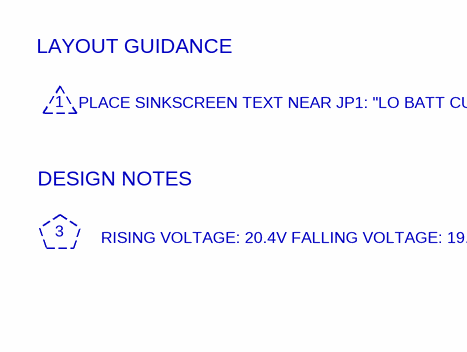
[diagram p4: 100046138_power.SchDoc, left]
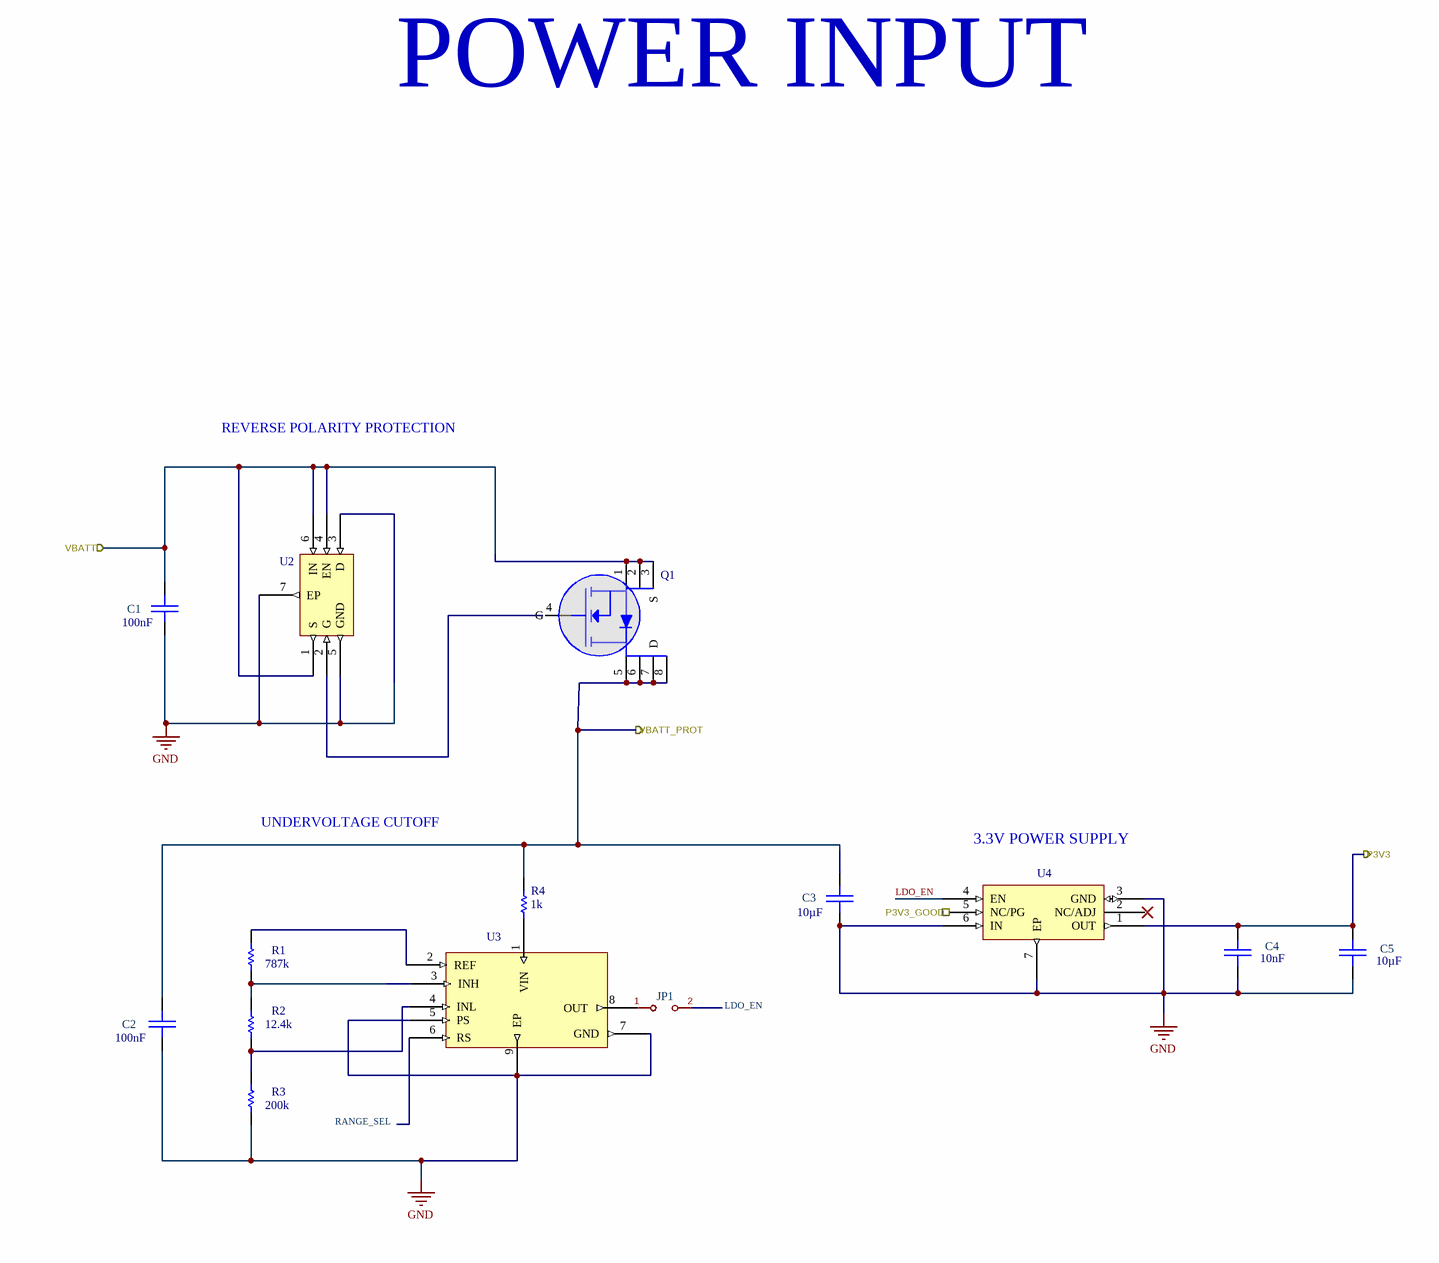
[diagram p5: 100046138_power.SchDoc, right]

### Parts
C1  value 100nF  [CAP-0402-A]  (hidden comment: Cap 0402 100nF 10% X7R)
C2  value 100nF  [CAP-0402-A]  (hidden comment: Cap 0402 100nF 10% X7R)
C3  value 10µF  [CAP-0805-A]  (hidden comment: CAP 0805 10UF 50V 10% X5R)
C4  value 10nF  [CAP-0402-A]  (hidden comment: Cap 0402 10000pf 50V 10% X7R)
C5  value 10µF  [CAP-0402-A]  (hidden comment: Cap 0402 10uF 10V 20% X5R)
JP1  Jumper_2_Bridged  [SolderJumper-2_P1.3mm_Open_TrianglePad1.0x1.5mm]  (value not drawn)
Q1  MOSFET - SINGLE - N CHANNEL - 8PIN  [IC-8PQFN-A]  (value not drawn)
R1  value 787k  [RES-0402-A]  (hidden comment: RES 0402 787K 1% 1/10W)
R2  value 12.4k  [RES-0402-A]  (hidden comment: RES 0402 12.4K 1% 1/16W)
R3  value 200k  [RES-0402-C]  (hidden comment: Res 0402 200K 1/16W 1% Thick Film)
R4  value 1k  [RES-0402-A]  (hidden comment: RES 0402 1K 1/10W 1%)
U2  NCV68261MTWAITBG  [IC-WDFN6-C]  (value not drawn)
U3  LTC2965HDD  [IC-DFN8-3x3-A]  (value not drawn)
U4  NCP730BMT330TBG  [IC-WDFN6-B]  (value not drawn)

### Ports
P3V3 (out), P3V3_GOOD (out), VBATT (in), VBATT_PROT (out)

### Nets
GND: C1.1 C2.1 C3.1 C4.1 C5.1 R3.1 U2.3(D) U2.5(GND) U2.7(EP) U3.5(PS) U3.7(GND) U3.9(EP) U4.3(GND) U4.6(IN) U4.7(EP)
LDO_EN: U4.4(EN)
VBATT: C1.2 Q1.1(S) Q1.2(S) Q1.3(S) U2.1(S) U2.4(EN) U2.6(IN) ; port VBATT
NetC2_2: C2.2 C3.2 Q1.5(D) Q1.6(D) Q1.7(D) Q1.8(D) R4.2 ; port VBATT_PROT
NetC4_2: C4.2 C5.2 U4.1(OUT) ; port P3V3
NetJP1_1: JP1.1(A) U3.8(OUT)
NetR1_1: R1.1 R2.2 U3.3(INH)
NetR1_2: R1.2 U3.2(REF)
NetR2_1: R2.1 R3.2 U3.4(INL)
NetU4_5: U4.5(NC/PG) ; port P3V3_GOOD

Not connected (* = marked no-connect by the designer): JP1 2(B); Q1 4(G); R4 1; U2 2(G); U3 1(VIN) 6(RS); U4 2(NC/ADJ)

### Notes on the sheet
- LAYOUT GUIDANCE
- 1
- PLACE SINKSCREEN TEXT NEAR JP1:
  "LO BATT CUTOFF"
- DESIGN NOTES
- 3
- RISING VOLTAGE: 20.4V
  FALLING VOLTAGE: 19.2V
- POWER INPUT
- REVERSE POLARITY PROTECTION
- UNDERVOLTAGE CUTOFF
- 3.3V POWER SUPPLY
- U4
- Labels drawn without touching a wire or pin: LDO_EN, RANGE_SEL
- DWG NO
- REVISIONS
- SH
- REVISION
- DESCRIPTION
- DATE(YEAR-MO-DA)
- APPROVED
- PART NO.
- DESIGN ACTIVITY
- US ARMY
  COMBAT CAPABILITIES DEVELOPMENT COMMAND ARMAMENTS CENTER
  PICATINNY ARSENAL, NEW JERSEY 07806-5000
- SIZE
- CAGE CODE
- DWG NO.
- D
- 19200
- SCALE
- NONE
- UNIT WT.
- ---
- SHEET

### Library data of the parts
C1 C2 = CAP-00363-2: as C28 on sheet 100046138_data_switches; Footprint: Capacitor_SMD:C_0402_1005Metric; Case/Package: 0402; Max Operating Temperature: 125°C; Min Operating Temperature: -55°C; Mounting Technology: Surface Mount; Tolerance: 10%
C3 = CAP-00370-1: Leader Qty: 100; UOM: EA; Footprint: Capacitor_SMD:C_0805_2012Metric; Case/Package: 0805; Dielectric: X5R; Max Operating Temperature: 85°C; Min Operating Temperature: -55°C; Mounting Technology: Surface Mount
C4 = CAP-00186-4: as C14 on sheet 100046138_output_control; Footprint: Capacitor_SMD:C_0402_1005Metric; Case/Package: 0402; Case Code (Imperial): 0402; Max Operating Temperature: 125°C; Min Operating Temperature: -55°C; Mounting Technology: Surface Mount; RoHS Compliant: Yes; Tolerance: 10%; Voltage Rating: 50V
C5 = CAP-00021-6: Capacitor Type: Ceramic; Leader Qty: 100; Footprint: Capacitor_SMD:C_0402_1005Metric; Case/Package: 0402; Max Operating Temperature: 85°C; Min Operating Temperature: -55°C; Mounting Technology: SMT; Pins: 2; RoHS Compliant: Yes; Tolerance: 20%; Voltage Rating: 10V
Q1 = CMP-00665-3: Transistor MOSFET N-Channel 40V 150A 8-Pin PQFN T/R; Manufacturer Lifecycle Status: ACTIVE; Drain to Source Resistance: 2.1mΩ; Gate to Source Voltage (Vgs): 20V; Max Junction Temperature (Tj): 150°C; Max Power Dissipation: 83W; Number of Channels: 1; Power Dissipation: 2.2W; Turn-Off Delay Time: 32ns; Turn-On Delay Time: 17ns; China RoHS: Non-Compliant; Continuous Drain Current (ID): 150A; Country of Origin: Philippines; Drain to Source Breakdown Voltage: 40V; Drain to Source Voltage (Vdss): 40V; Export Control Classification Number (ECCN) Code: EAR99; Height: 800µm; Introduction Date: 2019-11-12; Lifecycle Status: Production; Max Operating Temperature: 150°C; Min Breakdown Voltage: 40V; Min Operating Temperature: -55°C; Number of Elements: 1; Number of Terminals: 8; REACH SVHC: No; RoHS: Compliant; Schedule B: 8541290080, 8541290080
R1 = RES-00797-1: Leader Qty: 100; UOM: EA; Voltage Rating: 50V; Footprint: Resistor_SMD:R_0402_1005Metric; Case/Package: 0402; Max Operating Temperature: 155°C; Min Operating Temperature: -55°C; Mounting Technology: Surface Mount; Tolerance: 1%
R2 = RES-00798-1: Leader Qty: 100; UOM: EA; Voltage Rating: 50V; Footprint: Resistor_SMD:R_0402_1005Metric; Case/Package: 0402; Max Operating Temperature: 155°C; Min Operating Temperature: -55°C; Mounting Technology: Surface Mount; Pins: 2; Tolerance: 1%
R3 = RES-00272-5: Res Thick Film 0402 200K Ohm 1% 1/16W ±100ppm/°C Molded SMD SMD Paper Tape on Plastic Reel; Leader Qty: 100; Voltage Rating: 50V; Footprint: Resistor_SMD:R_0402_1005Metric; Case/Package: 0402; Max Operating Temperature: 125°C; Min Operating Temperature: -55°C; Mounting Technology: Surface Mount; RoHS Compliant: Yes; Tolerance: 1%
R4 = RES-00800-1: Leader Qty: 100; UOM: EA; Voltage Rating: 50V; Footprint: Resistor_SMD:R_0402_1005Metric; Case/Package: 0402; Max Operating Temperature: 155°C; Min Operating Temperature: -55°C; Mounting Technology: Surface Mount; Tolerance: 1%
U2 = IC-00420-2: OR Controller N-Channel Single 2.4Ohm Automotive 6-Pin WDFNW EP T/R; China RoHS: Compliant; Export Control Classification Number (ECCN) Code: EAR99; Harmonized Tariff Schedule (HTS) Code: 8542.39.00.60; Introduction Date: 2022-02-25; Lifecycle Status: Production; REACH SVHC: Yes; RoHS: Compliant
U3 = IC-00424-2: IC SUPERVISOR 1 CHANNEL 8DFN Supervisor Open Drain or Open Collector 1 Channel 8-DFN (3x3); Manufacturer Lifecycle Status: PRODUCTION; Max Junction Temperature (Tj): 150°C; Max Supply Voltage: 100V; Min Supply Voltage: 3.5V; Nominal Supply Current: 7µA; Number of Outputs: 1; Output Current: 5mA; Threshold Voltage: 400mV; Ambient Temperature Range High: 125°C; Case/Package: DFN; Height: 800µm; Lifecycle Status: Production; Max Operating Temperature: 125°C; Min Operating Temperature: -40°C; Mounting Technology: Surface Mount; Number of Voltages Monitored: 1; Pins: 8; REACH SVHC: No; RoHS: Compliant; Schedule B: 8542390000, 8542390000; Type: Monitor
JP1 = Jumper_2_Bridged: Value: Jumper_2_Bridged; Footprint: Jumper:SolderJumper-2_P1.3mm_Open_TrianglePad1.0x1.5mm
U4 = IC-00416-3: LDO Regulator, 150 mA, 38 V, 1 uA IQ, with PG 3V3 HZ, WDFN6 2x2; Manufacturer Lifecycle Status: ACTIVE; Accuracy: 1%; Dropout Voltage: 290mV; Max Junction Temperature (Tj): 125°C; Max Supply Voltage: 38V; Min Input Voltage: 4.3V; Number of Channels: 1; Output Current: 150mA; Output Voltage: 3.3V; Voltage Tolerance: 2%

## Nets that join several sheets
GND: 100046138_block_diagram (6 pins), 100046138_data_switches (9 pins), 100046138_output_control (37 pins), 100046138_power (15 pins)
GPIO0: 100046138_block_diagram (J6.1), 100046138_data_switches (U10.5)
NetC2_2: 100046138_output_control (5 pins), 100046138_power (7 pins)
NetC4_2: 100046138_data_switches (C28.2 C31.1 U9.9 U13.5), 100046138_output_control (13 pins), 100046138_power (C4.2 C5.2 U4.1)
NetC8_2: 100046138_block_diagram (J10.3), 100046138_output_control (C8.2 D4.K R9.2 R11.1)
NetC15_1: 100046138_block_diagram (J10.1 J10.9), 100046138_output_control (11 pins)
NetJ10_4: 100046138_block_diagram (J10.4), 100046138_data_switches (U10.2)
NetJ10_5: 100046138_block_diagram (J10.5), 100046138_data_switches (U10.1)
NetU4_5: 100046138_output_control (U5.4), 100046138_power (U4.5)
NetU11_4: 100046138_data_switches (U11.4), 100046138_output_control (U12.4)
USB_D+: 100046138_block_diagram (J8.1), 100046138_data_switches (U9.5)
USB_D-: 100046138_block_diagram (J7.1), 100046138_data_switches (U9.3)
USB_DEV_D-: 100046138_block_diagram (J10.6 J10.7 U1.K), 100046138_data_switches (U9.1 U9.7)
VBATT: 100046138_block_diagram (D1.K J1.1), 100046138_power (7 pins)